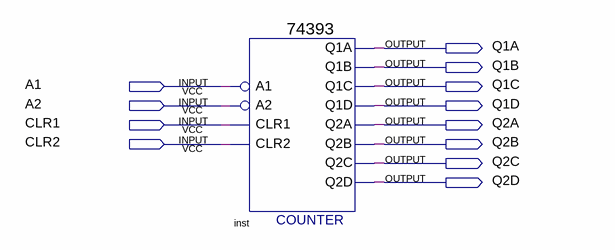
[diagram p0: schematic sheet]
// Quartus schematic lab_6_3.bdf as structural Verilog: 1 symbols, 12 pins
module lab_6_3 (
  input  A1,
  input  A2,
  input  CLR1,
  input  CLR2,
  output Q1A,
  output Q1B,
  output Q1C,
  output Q1D,
  output Q2A,
  output Q2B,
  output Q2C,
  output Q2D
);

  \74393  inst (
    .A1(A1), .CLR1(CLR1), .A2(A2), .CLR2(CLR2), .Q2D(Q2D), .Q2C(Q2C), .Q2B(Q2B), .Q1C(Q1C), .Q1D(Q1D),
    .Q2A(Q2A), .Q1A(Q1A), .Q1B(Q1B));
endmodule
